# Altium schematic sheet Source.SchDoc: Source
size A4; DrawnBy: Poon Mannchun; Revision: V 3.3
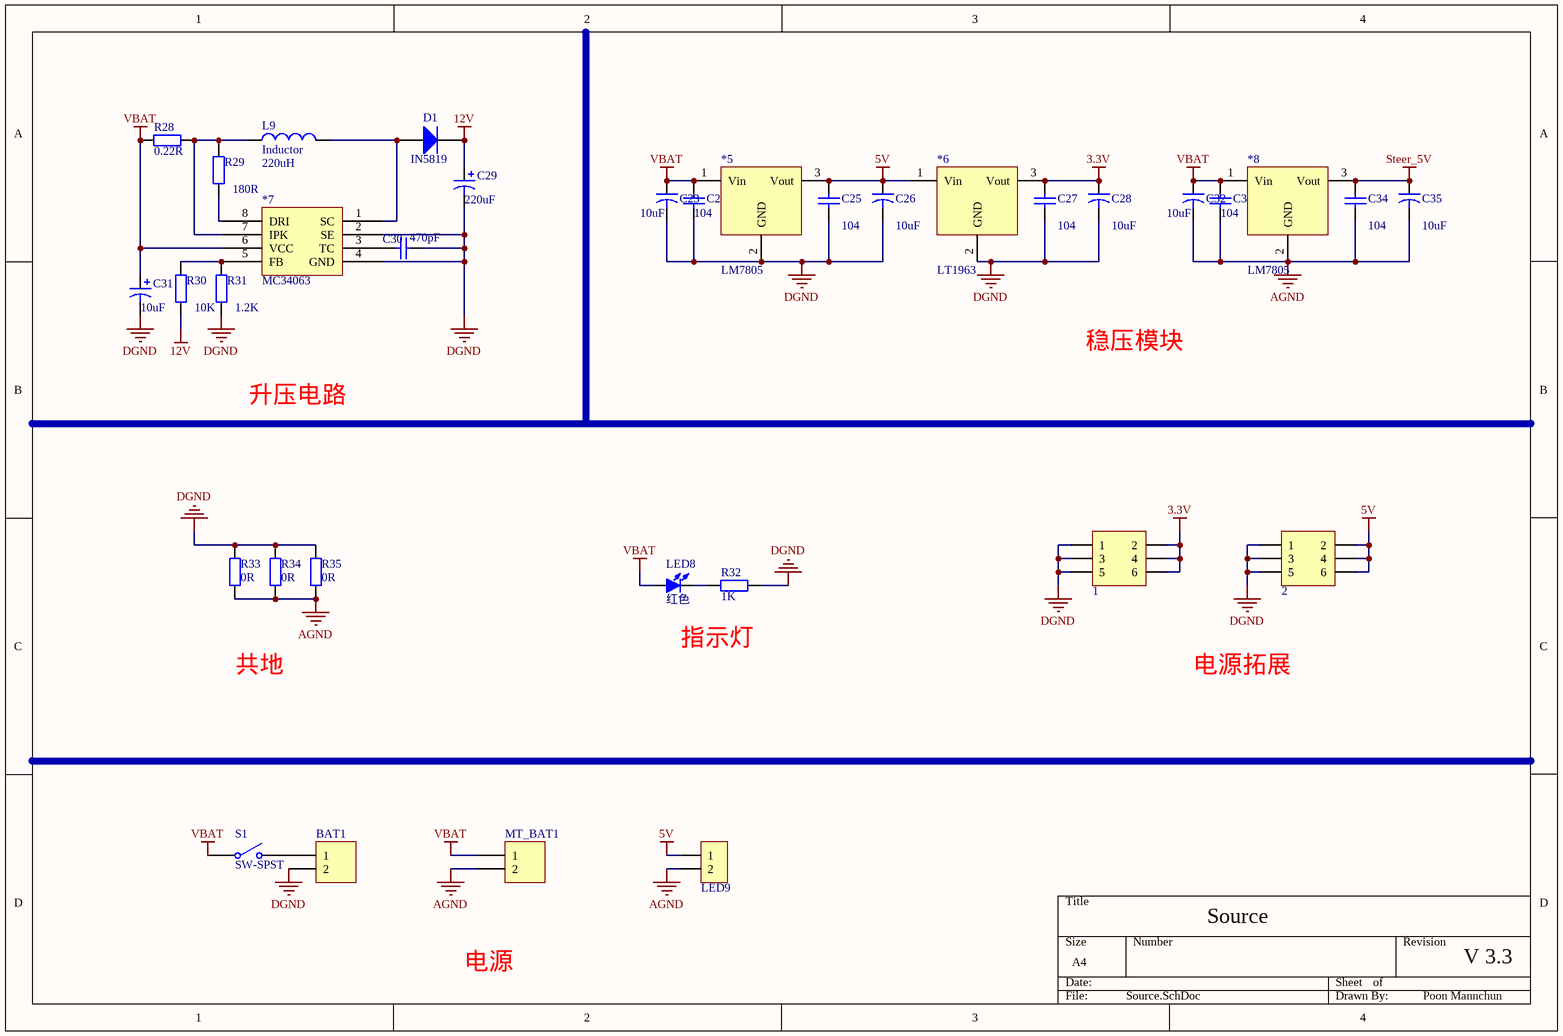
[diagram p0: Source.SchDoc]

## Parts
1  Header3X2  [HDR-3X2]  (value not drawn)
2  Header3X2  [HDR-3X2]  (value not drawn)
*5  LM7805  [SOT223_N]
*6  LT1963  [SOT223_N]
*7  MC34063  [SOP8_N]
*8  LM7805  [SOT223_N]
BAT1  Header 2  [SW - duplicate]  (value not drawn)
C23  value 10uF  [CD A(3216)]  (hidden comment: Cap2)
C24  104  [C 0805_L]
C25  104  [C 0805_L]
C26  value 10uF  [CD A(3216)]  (hidden comment: Cap2)
C27  104  [C 0805_L]
C28  value 10uF  [CD A(3216)]  (hidden comment: Cap2)
C29  value 220uF  [CD B(3528)]  (hidden comment: Cap Pol1)
C30  value 470pF  [C 0805_L]  (hidden comment: Cap)
C31  value 10uF  [CD A(3216)]  (hidden comment: Cap Pol1)
C32  value 10uF  [CD A(3216)]  (hidden comment: Cap2)
C33  104  [C 0805_L]
C34  104  [C 0805_L]
C35  value 10uF  [CD A(3216)]  (hidden comment: Cap2)
D1  IN5819  [SMA]
L9  Inductor  value 220uH  [CDRH124]
LED8  红色  [LED 0805R]
LED9  HDR-1X2  [HDR-1X2]  (value not drawn)
MT_BAT1  Header 2  [SW - duplicate]  (value not drawn)
R28  value 0.22R  [R 0805_L]  (hidden comment: Res2)
R29  value 180R  [R 0805_L]  (hidden comment: Res2)
R30  value 10K  [R 0805_L]  (hidden comment: Res2)
R31  value 1.2K  [R 0805_L]  (hidden comment: Res2)
R32  1K  [R 0805_L]
R33  value 0R  [R 0805_L]  (hidden comment: Res2)
R34  value 0R  [R 0805_L]  (hidden comment: Res2)
R35  value 0R  [R 0805_L]  (hidden comment: Res2)
S1  SW-SPST  [MTS-10x]

## Nets
3.3V: 1.2 1.4 1.6 *6.3(Vout) C27.2 C28.1
5V: 2.2 2.4 2.6 *5.3(Vout) *6.1(Vin) C25.2 C26.1 LED9.1
12V: C29.1 D1.2(K) R30.1
AGND: *8.2(GND) C32.2 C33.1 C34.1 C35.2 LED9.2 MT_BAT1.2 R33.2 R34.2 R35.2
DGND: 1.1 1.3 1.5 2.1 2.3 2.5 *5.2(GND) *6.2(GND) *7.2(SE) *7.4(GND) BAT1.2 C23.2 C24.1 C25.1 C26.2 C27.1 C28.2 C29.2 C30.2 C31.2 R31.1 R32.2 R33.1 R34.1 R35.1
Steer_5V: *8.3(Vout) C34.2 C35.1
VBAT: *5.1(Vin) *7.6(VCC) *8.1(Vin) C23.1 C24.2 C31.1 C32.1 C33.2 LED8.1(A) MT_BAT1.1 R28.2 S1.1(COMMON)
Net*7_1: *7.1(SC) D1.1(A) L9.2
Net*7_3: *7.3(TC) C30.1
Net*7_5: *7.5(FB) R30.2 R31.2
Net*7_7: *7.7(IPK) L9.1 R28.1 R29.2
Net*7_8: *7.8(DRI) R29.1
NetBAT1_1: BAT1.1 S1.2(NO)
NetLED8_2: LED8.2(K) R32.1

## Notes on the sheet
- 稳压模块
- 升压电路
- 指示灯
- 共地
- 电源拓展
- 电源

## Library data of the parts
1 2 = Header 3X2: 3*2P接插件; 版权归属: 源创客; BOM名称: 3*2P接插件; 学习资源: www.ooocke.com
*5 *6 *8 = LM2940
BAT1 MT_BAT1 = Header 2: Header, 2-Pin; LatestRevisionDate: 17-Jul-2002; LatestRevisionNote: Re-released for DXP Platform.; Publisher: Altium Limited
C23 C26 C28 C32 C35 = Cap2: Capacitor; Published: 23-Sep-2002; PackageReference: CAPR5-4X5; Publisher: Altium Limited; PackageDescription: Capacitor; 2 Leads
C24 C25 C27 C30 C33 C34 = Cap: Capacitor; Published: 8-Jun-2000; LatestRevisionDate: 17-Jul-2002; LatestRevisionNote: Re-released for DXP Platform.; PackageReference: RAD-0.3; Publisher: Altium Limited
  C24 C25 C27 C33 C34: PackageDescription: Radial Cap, Thru-Hole; 2 Leads; 0.3 in Pin Spacing; Value: 104
C29 C31 = Cap Pol1: Polarized Capacitor (Radial); Published: 8-Jun-2000; LatestRevisionDate: 17-Jul-2002; LatestRevisionNote: Re-released for DXP Platform.; PackageReference: RB7.6-15; Publisher: Altium Limited; PackageDescription: Polarized Capacitor (Radial); 2 Leads
D1 = Diode: Default Diode; Published: 8-Jun-2000; LatestRevisionDate: 17-Jul-2002; LatestRevisionNote: Re-released for DXP Platform.; PackageVersion: Sep-1996; PackageReference: SMC; Publisher: Altium Limited; PackageDescription: DO-214-AB/SMC; 2 C-Bend Leads; Body 7.9 x 5.9 mm, inc. leads (LxW); Code_JEDEC: DO-214-AB
L9 = Inductor: Code_IEC: 1005; Published: 8-Jun-2000; LatestRevisionDate: 29-May-2009; LatestRevisionNote: IPC-7351 Footprint Added.; PackageReference: 0402-A; Publisher: Altium Limited; PackageDescription: Chip Inductor; Code_JEITA: 0402
LED8 = LED-SMD: 贴片LED; 版权归属: 源创客; BOM名称: 贴片LED; 学习资源: www.ooocke.com
LED9 = Header 2: 2P接插件; 版权归属: 源创客; BOM名称: 2P接插件; 学习资源: www.ooocke.com
R28-R35 = Res2: Resistor; Published: 8-Jun-2000; LatestRevisionDate: 17-Jul-2002; LatestRevisionNote: Re-released for DXP Platform.; PackageReference: AXIAL-0.4; Publisher: Altium Limited
  R28-R31 R33-R35: PackageDescription: Axial Device, Thru-Hole; 2 Leads; 0.4 in Pin Spacing
S1 = SW-SPST: Single-Pole, Single-Throw Switch; Published: 24-Mar-1999; LatestRevisionDate: 17-Jul-2002; LatestRevisionNote: Re-released for DXP Platform.; PackageReference: SPST-2; Publisher: Altium Limited; PackageDescription: Switch; 2 Leads